# EAGLE design linearSensor (EAGLE 7.1.0)
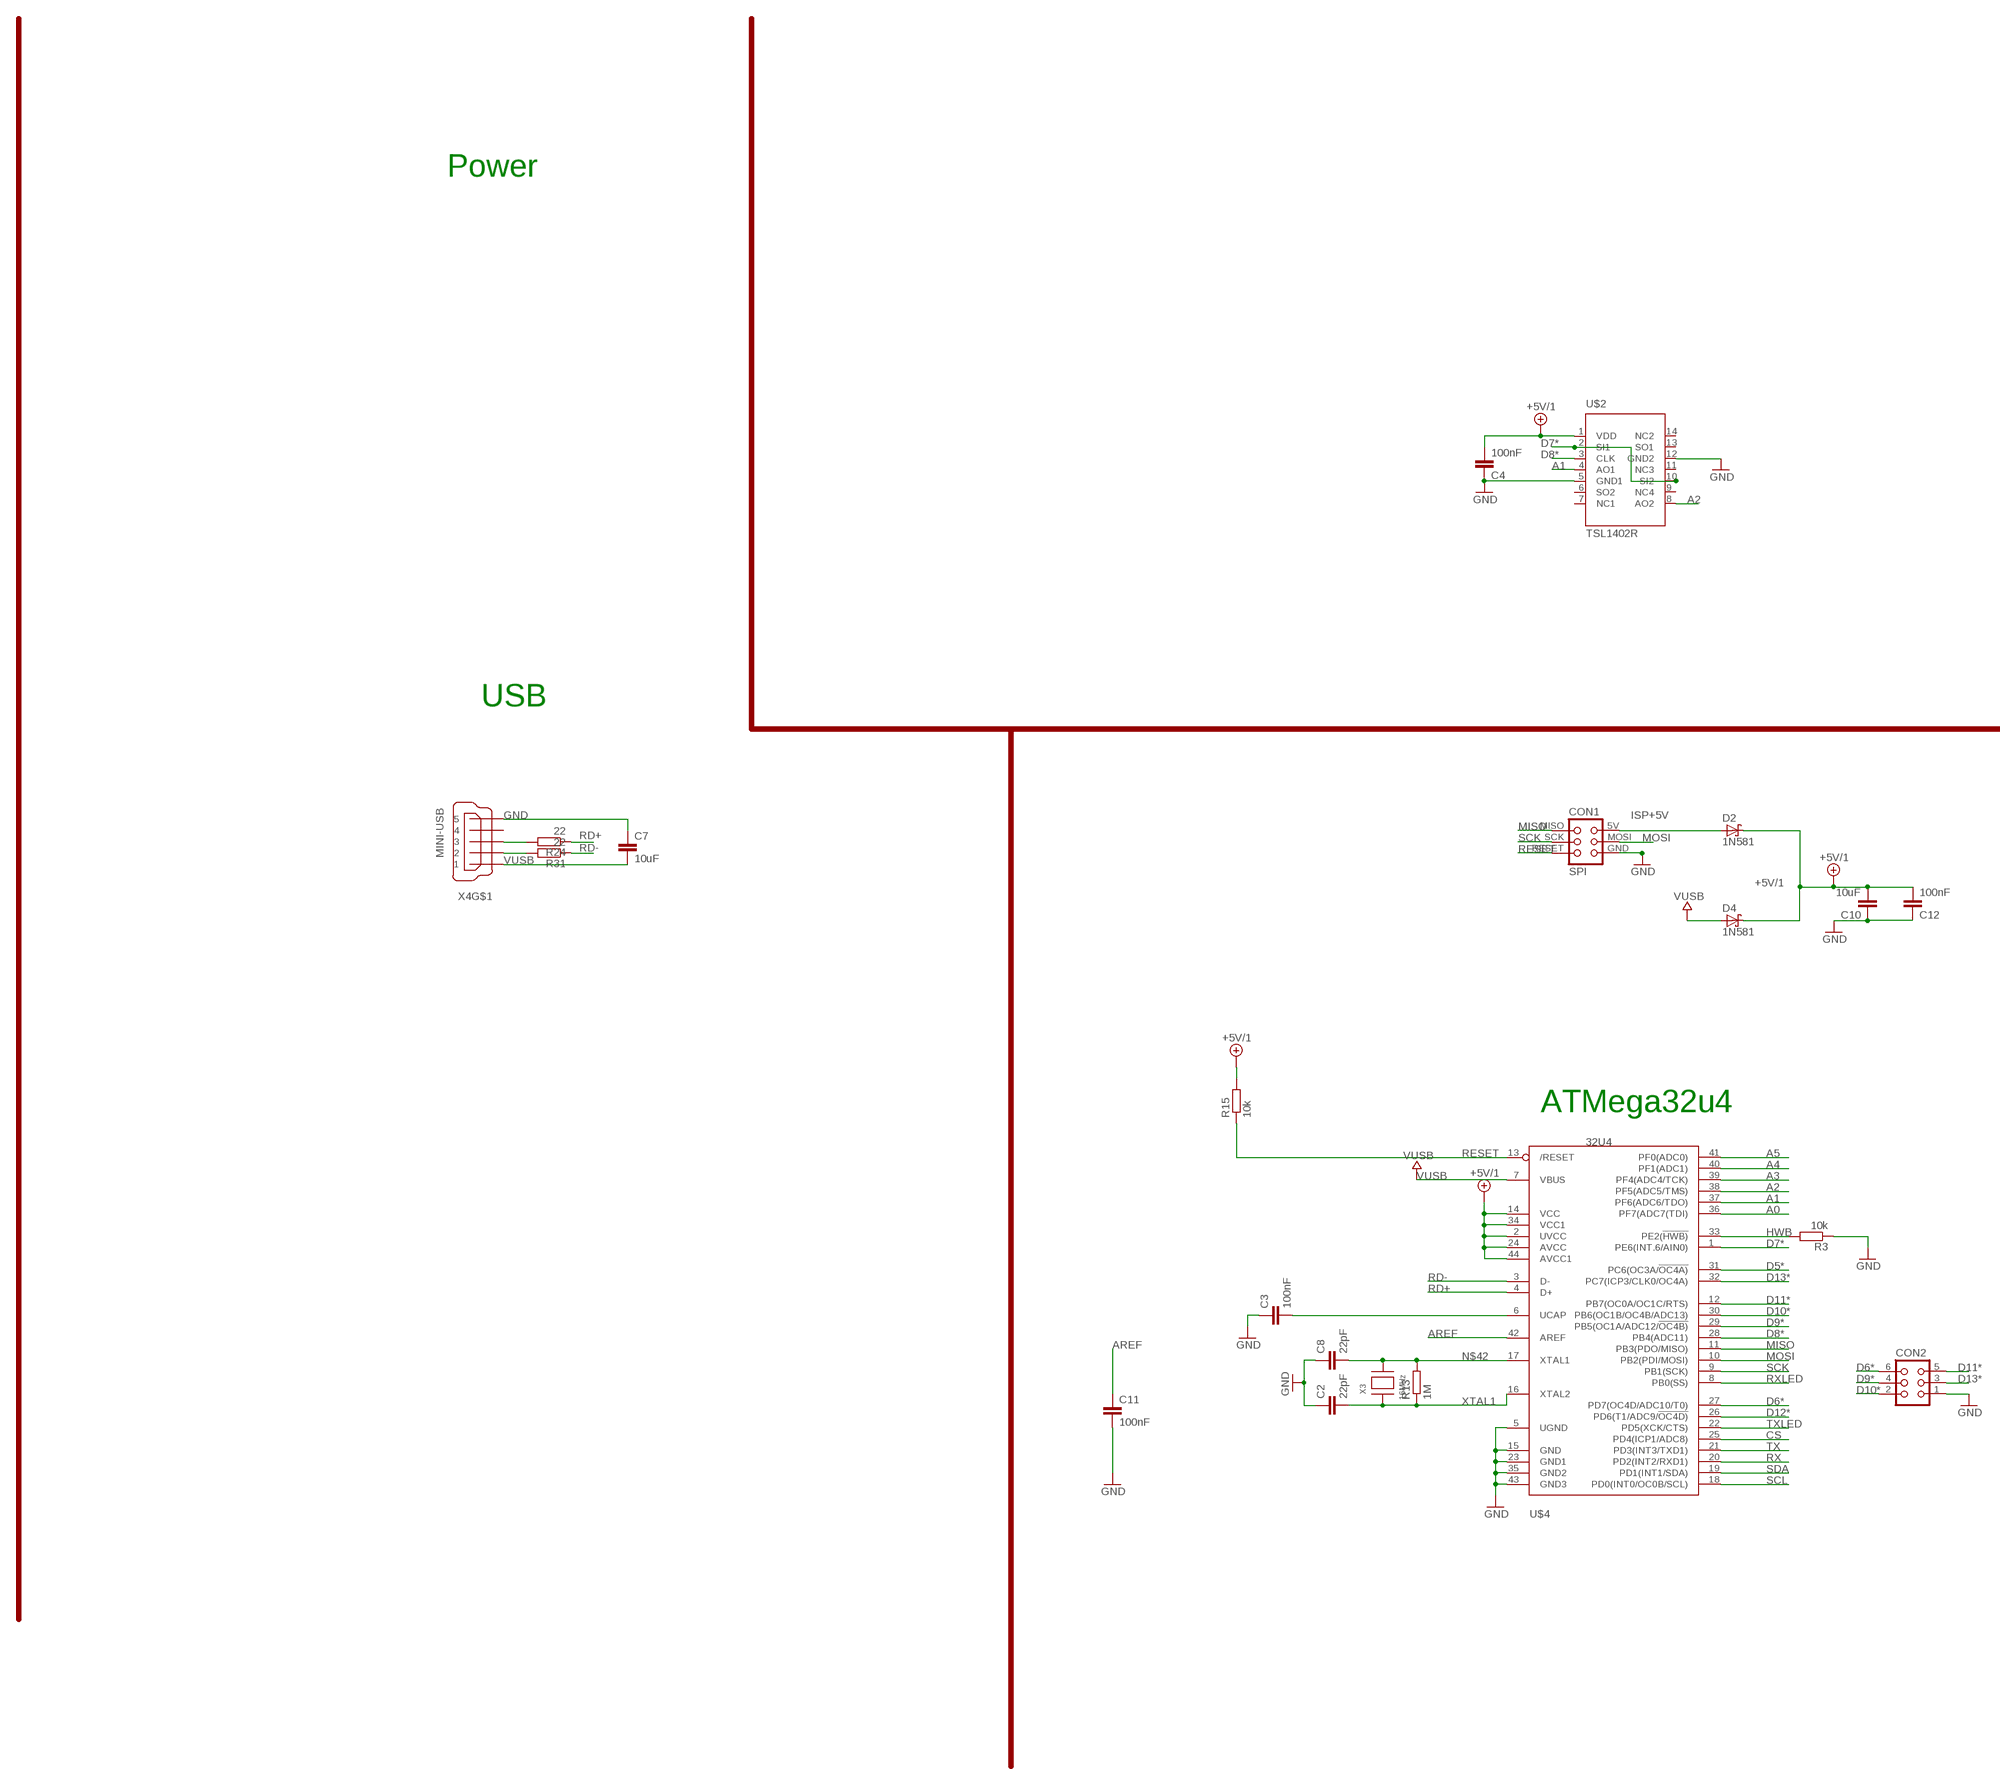
[diagram p0: schematic, sheet 1, part 1 of 2]
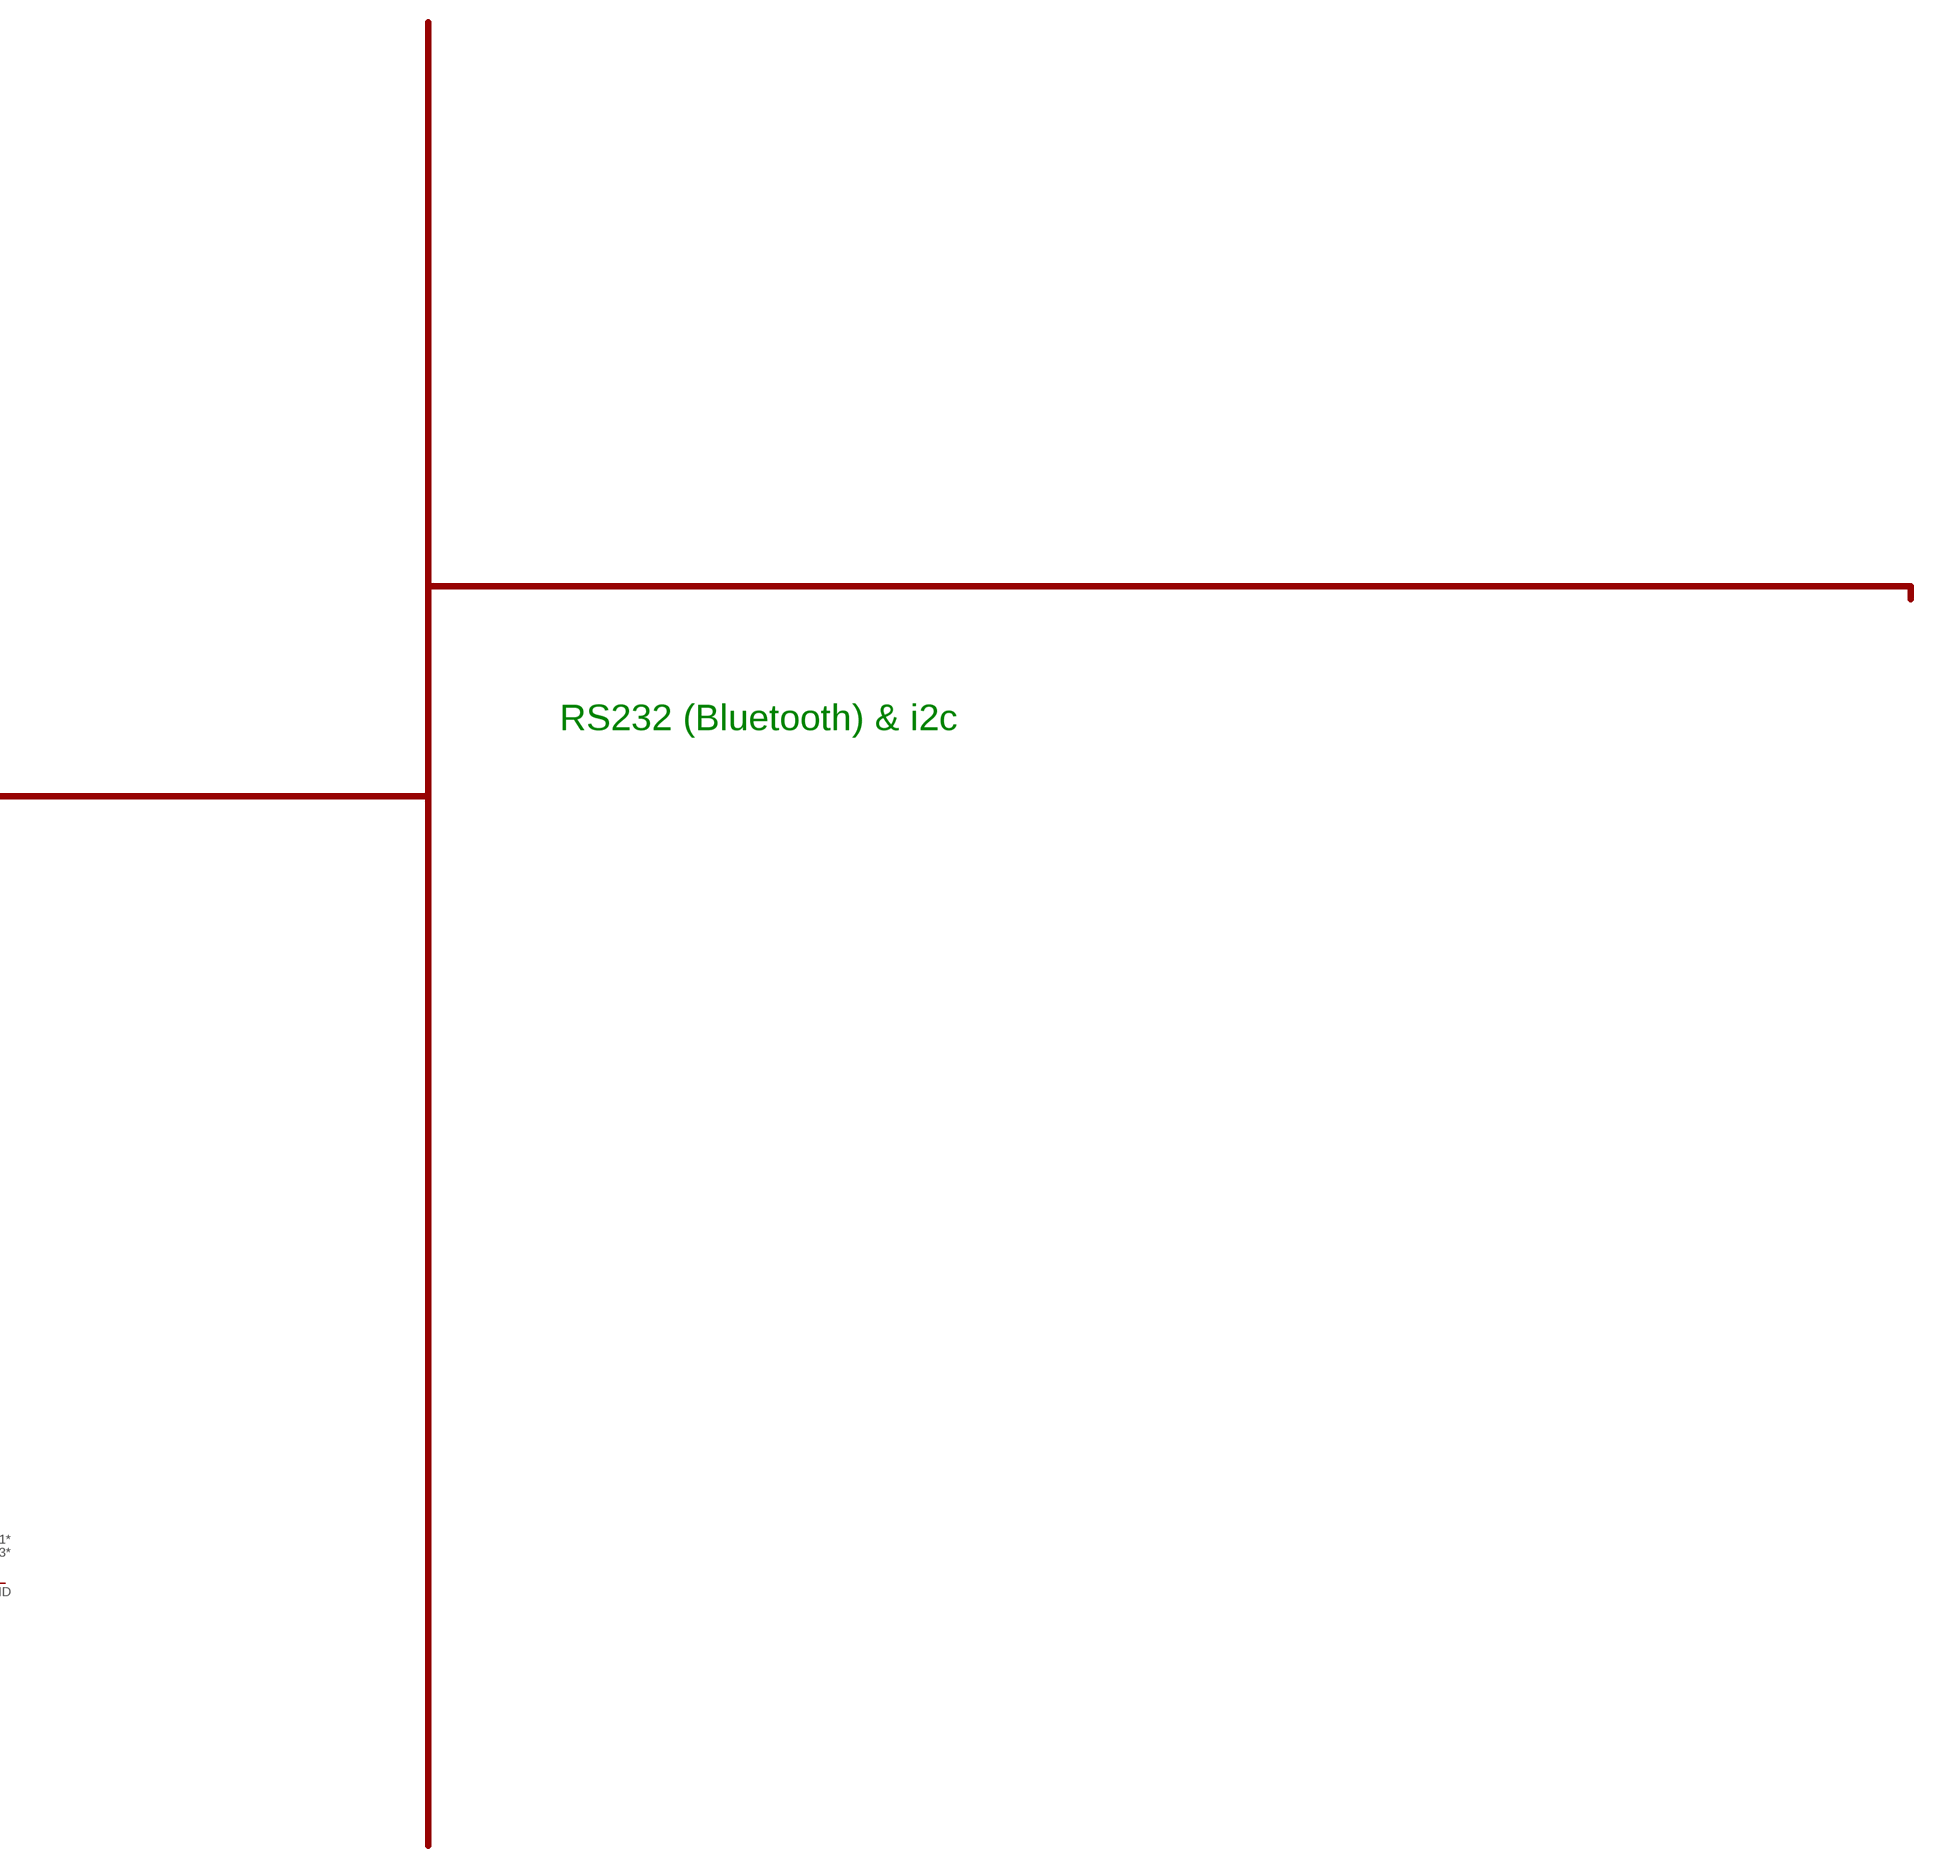
[diagram p1: schematic, sheet 1, part 2 of 2]

## Parts
C2  22pF  C-EUC1206  [C1206]
C3  100nF  C-EUC1206  [C1206]
C4  100nF  C-EUC1206  [C1206]
C7  10uF  C-EUC1206  [C1206]
C8  22pF  C-EUC1206  [C1206]
C10  10uF  C-EUC1206  [C1206]
C11  100nF  C-EUC1206  [C1206]
C12  100nF  C-EUC1206  [C1206]
CON1  SPI  TINYISPT  [TC2030-MCP-NL]
CON2  CON06  [CON06]
D2  1N581  1N581D1206  [LED-1206]
D4  1N581  1N581D1206  [LED-1206]
R3  10k  R-EU_M0805  [M0805]
R13  1M  R-EU_R1206  [R1206]
R15  10k  R-EU_M0805  [M0805]
R24  22  R-EU_M1206  [M1206]
R31  22  R-EU_M1206  [M1206]
U$2  TSL1402R  [DIL14]
U$4  32U4  ATMEGA32U4-AU  [TQFP44]
X3  16MHz  XTALNX6035  [NX6035]
X4  MINI-USB  MINI-USB-SCHIELD-32005-201  [32005-201]

## Nets
+5V/1 [fine]: C4.2 C10.2 C12.2 D2.C D4.C R15.2 U$2.1(VDD) U$4.2(UVCC) U$4.14(VCC) U$4.24(AVCC) U$4.34(VCC1) U$4.44(AVCC1)
A0: U$4.36(PF7(ADC7(TDI))
A1: U$2.4(AO1) U$4.37(PF6(ADC6/TDO))
A2: U$2.8(AO2) U$4.38(PF5(ADC5/TMS))
A3: U$4.39(PF4(ADC4/TCK))
A4: U$4.40(PF1(ADC1))
A5: U$4.41(PF0(ADC0))
AREF: C11.1 U$4.42(AREF)
CS: U$4.25(PD4(ICP1/ADC8))
D5*: U$4.31(PC6(OC3A/!OC4A))
D6*: CON2.6 U$4.27(PD7(OC4D/ADC10/T0))
D7*: U$2.2(SI1) U$2.10(SI2) U$4.1(PE6(INT.6/AIN0))
D8*: U$2.3(CLK) U$4.28(PB4(ADC11))
D9*: CON2.4 U$4.29(PB5(OC1A/ADC12/!OC4B))
D10*: CON2.2 U$4.30(PB6(OC1B/OC4B/ADC13))
D11*: CON2.5 U$4.12(PB7(OC0A/OC1C/RTS))
D12*: U$4.26(PD6(T1/ADC9/!OC4D))
D13*: CON2.3 U$4.32(PC7(ICP3/CLK0/OC4A))
D+USB: R24.2 X4.3
D-USB: R31.2 X4.2
GND [power]: C2.1 C3.1 C4.1 C7.1 C8.1 C10.1 C11.2 C12.1 CON1.GND CON2.1 R3.1 U$2.5(GND1) U$2.12(GND2) U$4.5(UGND) U$4.15(GND) U$4.23(GND1) U$4.35(GND2) U$4.43(GND3) X4.5
HWB: R3.2 U$4.33(PE2(!HWB))
ISP+5V: CON1.5V(VCC) D2.A
MISO: CON1.MISO U$4.11(PB3(PDO/MISO))
MOSI: CON1.MOSI U$4.10(PB2(PDI/MOSI))
N$16: C3.2 U$4.6(UCAP)
N$42: C8.2 R13.2 U$4.17(XTAL1) X3.P$2
RD+: R24.1 U$4.4(D+)
RD-: R31.1 U$4.3(D-)
RESET: CON1.RESET R15.1 U$4.13(/RESET)
RX: U$4.20(PD2(INT2/RXD1))
RXLED: U$4.8(PB0(SS))
SCK: CON1.SCK U$4.9(PB1(SCK))
SCL: U$4.18(PD0(INT0/OC0B/SCL))
SDA: U$4.19(PD1(INT1/SDA))
TX: U$4.21(PD3(INT3/TXD1))
TXLED: U$4.22(PD5(XCK/CTS))
VUSB: C7.2 D4.A U$4.7(VBUS) X4.1
XTAL1: C2.2 R13.1 U$4.16(XTAL2) X3.P$1
Unconnected: U$2.6(SO2) U$2.7(NC1) U$2.9(NC4) U$2.11(NC3) U$2.13(SO1) U$2.14(NC2) X4.4 X4.M1(S:S1) X4.M2(S:S2) X4.M3(S:S3) X4.M4(S:S4)

## Notes on the sheet
- Power
- RS232 (Bluetooth) & i2c
- USB
- ATMega32u4

## Library data of the parts
C2-C4 C7 C8 C10-C12 = rcl:C-EU: CAPACITOR, European symbol
CON1 = lpatiny:TINYISP: CONNECTOR
CON2 = con-harting:CON06: CONNECTOR; OC_FARNELL: unknown; OC_NEWARK: unknown
D2 D4 = lpatiny:1N581*: 1.0A SCHOTTKY BARRIER RECTIFIER Source: http://www.diodes.com/datasheets/ds23001.pdf
R3 R15 R24 R31 = resistor:R-EU_: RESISTOR, European symbol
R13 = rcl:R-EU_: RESISTOR, European symbol
U$2 = lpatiny:TSL1402R
U$4 = adafruit:ATMEGA32U4: http://www.ladyada.net/library/eagle
X3 = lpatiny:XTAL: Low cost SMT crystals, no capacitors included http://www.ladyada.net/library/eagle
X4 = con-cypressindustries:MINI-USB-SCHIELD-: MINI USB-B Conector Source: www.cypressindustries.com; OC_FARNELL: unknown; OC_NEWARK: unknown

## Net classes
0 default: width 0.305 mm
1 power: width 0.457 mm
2 VIN: width 0.457 mm
3 fine: width 0.305 mm
4 aref: width 0.305 mm

## Board
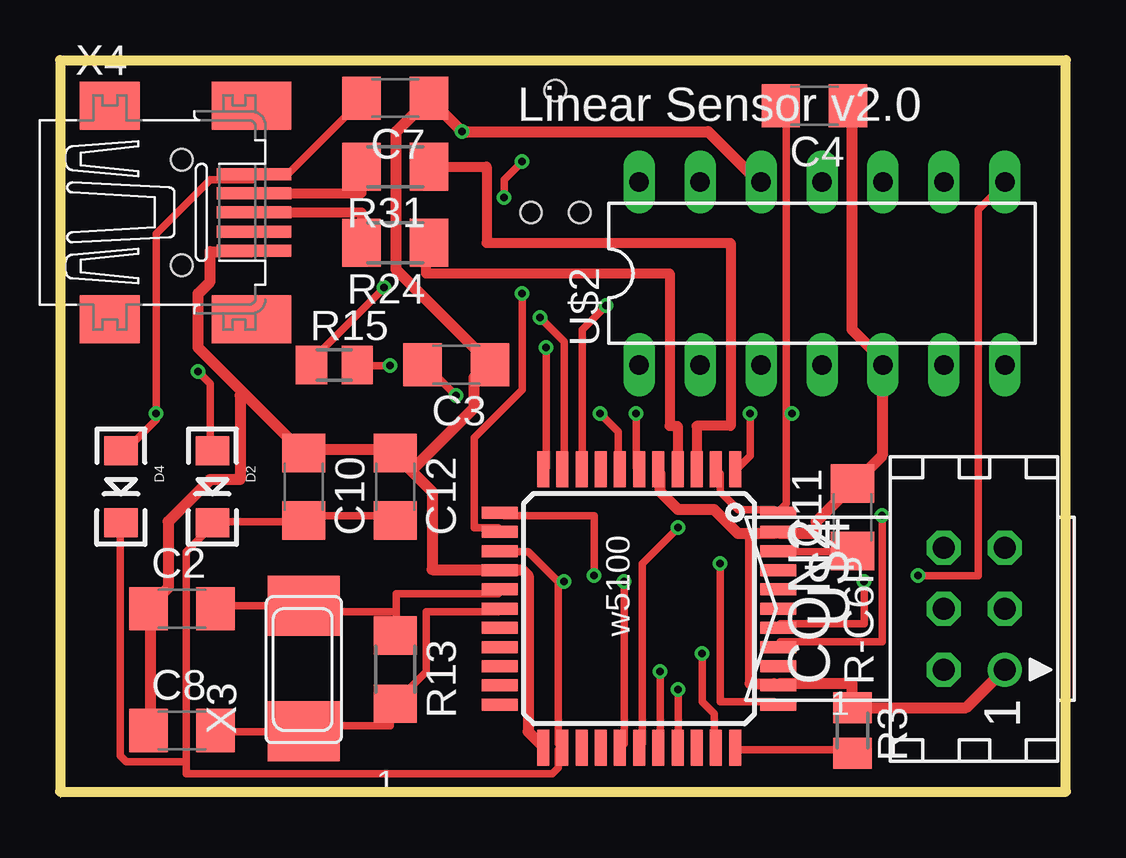
[diagram p2: board, top side]
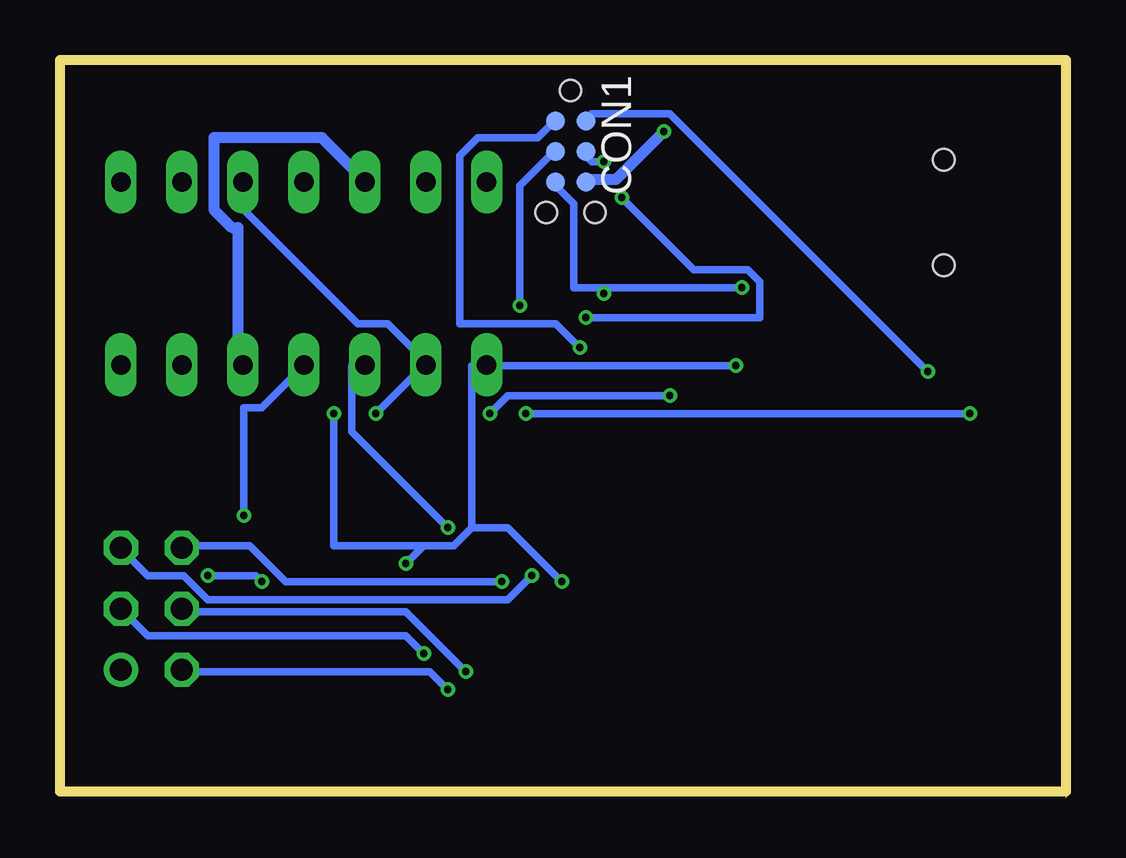
[diagram p3: board, bottom side, seen from below]

Size 41.91 x 30.73 mm. Coordinates in mm from the lower left corner, seen from the top.
Outline: 0,0.25 0,0
Outline: 0,0.25 0,30.73 41.91,30.73 41.91,0.25 0,0.25
Copper layers (1*16): Top 0.035mm / dielectric 1.5mm / Bottom 0.035mm
Design rules "Fusion_eagle_rule_v1.1": minimum track width 6mil, minimum drill 12mil, track to track 6mil, track to pad 6mil, pad to pad 6mil, via to via 6mil, smd to smd 0mil, copper to edge 10mil, drill to drill 10mil, minimum pad ring 10mil, minimum via ring 6mil, stop-mask expansion 2mil, vias tented up to drill 100mil, thermal gap 10mil
vRestrict: area 16.5,0.3 to 31.8,4.1; area 16.5,1.5 to 20.3,15.5; area 27.9,2.8 to 31.8,15.5; area 16.5,11.7 to 31.8,15.5

### Footprints (pad centres in the part's own frame; a part is rotated, then mirrored left to right if it is on the bottom)
C1206 = smd 1.6 x 1.8: 1 -1.4,0; 2 1.4,0
TC2030-MCP-NL = smd 0.787 x 0.787: 5V 1.27,0.635; GND 3.81,0.635; MISO 1.27,-0.635; MOSI 2.54,0.635; RESET 3.81,-0.635; SCK 2.54,-0.635 | hole 0.889: 0,0; 5.08,-1.016; 5.08,1.016
CON06 = drill 0.914: 1 -2.54,-1.27 | drill 0.914 octagon: 2 -2.54,1.27; 3 0,-1.27; 4 0,1.27; 5 2.54,-1.27; 6 2.54,1.27
LED-1206 = smd 1.2 x 1.4: A -1.5,0; C 1.5,0
M0805 = smd 1.3 x 1.6: 1 -0.95,0; 2 0.95,0
R1206 = smd 1.6 x 1.803: 1 -1.422,0; 2 1.422,0
M1206 = smd 1.6 x 2: 1 -1.4,0; 2 1.4,0
DIL14 = drill 0.813 long: 1 -7.62,-3.81; 2 -5.08,-3.81; 3 -2.54,-3.81; 4 0,-3.81; 5 2.54,-3.81; 6 5.08,-3.81; 7 7.62,-3.81; 8 7.62,3.81; 9 5.08,3.81; 10 2.54,3.81; 11 0,3.81; 12 -2.54,3.81; 13 -5.08,3.81; 14 -7.62,3.81
TQFP44 = smd 1.5 x 0.5: 1 -5.8,4; 2 -5.8,3.2; 3 -5.8,2.4; 4 -5.8,1.6; 5 -5.8,0.8; 6 -5.8,0; 7 -5.8,-0.8; 8 -5.8,-1.6; 9 -5.8,-2.4; 10 -5.8,-3.2; 11 -5.8,-4; 23 5.8,-4; 24 5.8,-3.2; 25 5.8,-2.4; 26 5.8,-1.6; 27 5.8,-0.8; 28 5.8,0; 29 5.8,0.8; 30 5.8,1.6; 31 5.8,2.4; 32 5.8,3.2; 33 5.8,4 | smd 0.5 x 1.5: 12 -4,-5.8; 13 -3.2,-5.8; 14 -2.4,-5.8; 15 -1.6,-5.8; 16 -0.8,-5.8; 17 0,-5.8; 18 0.8,-5.8; 19 1.6,-5.8; 20 2.4,-5.8; 21 3.2,-5.8; 22 4,-5.8; 34 4,5.8; 35 3.2,5.8; 36 2.4,5.8; 37 1.6,5.8; 38 0.8,5.8; 39 0,5.8; 40 -0.8,5.8; 41 -1.6,5.8; 42 -2.4,5.8; 43 -3.2,5.8; 44 -4,5.8
NX6035 = smd 2.5 x 3: P$1 2.665,0; P$2 -2.565,0
32005-201 = smd 3.1 x 0.5: 1 3,1.6; 2 3,0.8; 3 3,0; 4 3,-0.8; 5 3,-1.6 | smd 2.5 x 2: M1 -3,-4.45; M2 -3,4.45 | smd 3.3 x 2: M3 2.9,4.45; M4 2.9,-4.45 | hole 0.9: 0,2.2; 0,-2.2

### Placement (x,y rotation side)
C2  5.08,7.87 0 top
C3  16.51,18.03 180 top
C4  31.43,28.83 180 top
C7  13.97,29.15 180 top
C8  5.08,2.79 0 top
C10  10.16,12.95 270 top
C11  33.02,11.68 90 top
C12  13.97,12.95 270 top
CON1  20.64,29.46 270 bottom
CON2  38.1,7.87 90 top
D2  6.35,12.95 270 top
D4  2.54,12.95 270 top
R3  33.02,2.79 270 top
R13  13.97,5.33 270 top
R15  11.43,18.03 0 top
R24  13.97,23.11 180 top
R31  13.97,26.29 180 top
U$2  31.75,21.84 0 top
U$4  24.13,7.87 270 top
X3  10.16,5.33 90 top
X4  5.08,24.38 0 top

### Tracks (layer width: path | path; a pad name or v marks a point on that pad's centre or on a via)
+5V/1  (via drill 0.3)
  Top 0.305: 20.75,9 20.75,2.25 U$4.24 20.75,2 20.75,1.25 20.5,1 5.25,1 5.25,1.5 | 20.75,9 19.5,10.25 18.5,10.25 U$4.14 | C12.2 13.75,11.75 10.25,11.75 C10.2 10,11.5 6.5,11.5 D2.C 6.25,11.25 5.25,10.25 5.25,1.5 | 5.25,1.5 2.75,1.5 2.5,1.75 2.5,11.25 D4.C | U$4.2 27.5,13.5 27.5,12.75 28.25,12 29.75,12 U$4.44 30,12 30.25,12.25 30.25,16 | 30.25,16 30.25,28.75 C4.2 | v27.5,9.75 27.5,4 29.75,4 U$4.34 | v13.75,18 12.5,18 R15.2 | v30.5,16 30.25,16 | v21,9 20.75,9
  Bottom 0.305: 26.75,10.5 v27.5,9.75 | 26.75,10.5 25.5,10.5 24.75,11.25 | 24.75,11.25 24.75,18 24.25,18 U$2.1 24,18 v13.75,18 | v30.5,16 30.5,10.5 26.75,10.5 | v21,9 23.25,11.25 24.75,11.25
A1  (via drill 0.3)
  Top 0.305: v34.25,11.75 34.25,6.5 30,6.5 U$4.37
  Bottom 0.305: v34.25,11.75 34.25,16.25 33.5,16.25 31.75,18 U$2.4
A2  (via drill 0.3)
  Top 0.305: v33.5,9 33.5,7.25 30,7.25 U$4.38 | v35.75,9.25 38.25,9.25 38.25,24.5 39.25,25.5 U$2.8
  Bottom 0.305: v33.5,9 33.75,9.25 v35.75,9.25
AREF
  Top 0.305: U$4.42 30,10.25 33,10.25 C11.1
D6*  (via drill 0.3)
  Top 0.305: v23.5,9 23.5,2.25 U$4.27
  Bottom 0.305: v23.5,9 32.5,9 34,10.5 36.75,10.5 CON2.6
D7*  (via drill 0.3)
  Top 0.305: v28.75,16 28.75,14.25 28.25,13.75 U$4.1
  Bottom 0.305: v28.75,16 26.75,18 U$2.2 26.75,18.25 28.25,19.75 29.5,19.75 34.25,24.5 34.25,25.5 U$2.10
D8*  (via drill 0.3)
  Top 0.305: v25.75,11.25 24.25,9.75 24.25,2.25 U$4.28
  Bottom 0.305: v25.75,11.25 29.75,15.25 29.75,18 29.25,18 U$2.3
D9*  (via drill 0.3)
  Top 0.305: v25,5.25 25,2.25 U$4.29
  Bottom 0.305: v25,5.25 27.5,7.75 36.75,7.75 CON2.4
D10*  (via drill 0.3)
  Top 0.305: v25.75,4.5 25.75,2.25 U$4.30
  Bottom 0.305: v25.75,4.5 26.5,5.25 36.75,5.25 CON2.2
D11*  (via drill 0.3)
  Top 0.305: v22.25,9.25 22.25,11.75 18.5,11.75 U$4.12
  Bottom 0.305: v22.25,9.25 23.25,8.25 35.75,8.25 36.75,9.25 38.25,9.25 39.25,10.25 CON2.5
D13*  (via drill 0.3)
  Top 0.305: v26.75,6 26.75,4 27.25,3.5 27.25,2.25 U$4.32
  Bottom 0.305: v26.75,6 27.5,6.75 38.25,6.75 CON2.3
D+USB
  Top 0.406: X4.3 12.57,24.38 R24.2
D-USB
  Top 0.406: X4.2 12.57,25.18 R31.2
GND  (via drill 0.3)
  Top 0.457: CON2.1 39.25,5.25 37.75,3.75 33.25,3.75 R3.1 33,3.75 33,4.75 30,4.75 U$4.35 29.75,4.75 28.75,4.75 28.75,11 | 28.75,11 29.75,11 U$4.43 30,11 31.5,11 31.5,11.5 33,13 C11.2 33.25,13.25 34.25,14.25 34.25,18 U$2.5 34.25,18.25 33,19.5 33,28.75 C4.1 | 28.75,11 28.25,11 27.25,12 25.75,12 25,12.75 25,13.5 U$4.5 | U$2.12 29,25.75 27,27.75 v16.75,27.75 15.5,29 C7.1 15.25,29 14,27.75 14,22 17.75,18.25 C3.1 17.75,18 17.25,17.5 17.25,16.25 14.75,13.75 C12.1 | C8.1 3.75,3 3.75,7.75 C2.1 3.75,8 4.5,8.75 4.5,11.5 6.25,13.25 7.5,13.25 7.5,16.75 7.62,16.88 | C12.1 14,14.25 15.5,12.75 15.5,9.5 18.25,9.5 U$4.15 18.5,9.5 19.25,9.5 19.5,9.25 19.5,2.75 20,2.25 U$4.23 | C12.1 13.75,14.5 10.25,14.5 C10.1 10,14.5 7.62,16.88 | 7.62,16.88 5.75,18.75 5.75,21 6.25,21.5 6.25,22.75 8,22.75 X4.5
  Bottom 0.457: v16.75,27.75 18.75,25.75 20,25.75 CON1.GND | U$2.5 34.5,18.25 34.5,23.75 34.75,23.75 35.5,24.5 35.5,27.5 31,27.5 29.25,25.75 U$2.12
HWB
  Top 0.305: U$4.33 28.25,2 33,2 R3.2
ISP+5V  (via drill 0.3)
  Top 0.305: v5.75,17.75 6.25,17.25 6.25,14.5 D2.A
  Bottom 0.305: v5.75,17.75 16.5,28.5 19.75,28.5 20,28.25 CON1.5V
MISO  (via drill 0.3)
  Top 0.305: v20.25,18.75 20.25,13.75 U$4.11
  Bottom 0.305: v20.25,18.75 21.25,19.75 25.25,19.75 25.25,26.75 24.5,27.5 22,27.5 21.5,28 CON1.MISO
MOSI  (via drill 0.3)
  Top 0.305: v19.25,26.5 18.5,25.75 v18.5,25 | v20,20 21,19 21,13.75 U$4.10
  Bottom 0.305: v19.25,26.5 19.75,26.5 20,26.75 CON1.MOSI | v18.5,25 15.5,22 13.25,22 12.75,21.5 12.75,20 v20,20
N$16  (via drill 0.3)
  Top 0.305: v24,16 24,13.75 U$4.6 | v16.5,16.75 15.25,18 C3.2
  Bottom 0.305: v24,16 23.25,16.75 v16.5,16.75
N$42
  Top 0.305: C8.2 6.5,2.75 10,2.75 X3.P$2 10.25,3 13.75,3 13.75,3.75 R13.2 14,4 15.25,5.25 15.25,7.75 18.25,7.75 U$4.17
RD+
  Top 0.406: U$4.4 25.73,15.49 25.4,15.49 25.4,21.84 15.24,21.84 15.24,23.11 R24.1
RD-
  Top 0.406: R31.1 17.78,26.29 17.78,23.11 27.94,23.11 27.94,15.49 26.53,15.49 U$4.3
RESET  (via drill 0.3)
  Top 0.305: v13.5,21.25 10.5,18.25 R15.1 | v19.25,21 19.25,17 17.25,15 17.25,11.25 18.25,11.25 U$4.13
  Bottom 0.305: v13.5,21.25 19.25,21.25 | 19.25,21.25 20.5,21.25 20.5,24.75 21.25,25.5 CON1.RESET | 19.25,21.25 v19.25,21
SCK  (via drill 0.3)
  Top 0.305: v22.75,20.5 21.75,19.5 21.75,13.75 U$4.9
  Bottom 0.305: v22.75,20.5 22.75,25.5 21.5,26.75 CON1.SCK
VUSB  (via drill 0.3)
  Top 0.305: D4.A 2.75,14.5 4,15.75 v4,16 4,23.5 6.25,25.75 8,25.75 X4.1 8.25,26 9.5,26 12.5,29 C7.2 | v22.5,16 23.25,15.25 23.25,13.75 U$4.7
  Bottom 0.305: v4,16 v22.5,16
XTAL1
  Top 0.305: 14,7.75 14,7 R13.1 | 14,7.75 14,8.5 18.25,8.5 U$4.16 | C2.2 6.5,8 10,8 X3.P$1 10.25,7.75 14,7.75

### Text on the board
tPlace: Linear Sensor v2.0
tNames: w5100 | 1 | 1
203bmp: C:/Users/G/Pictures/logo_epfl.bmp